# EAGLE design FAN-zero20-SHIM (EAGLE 9.6.2)
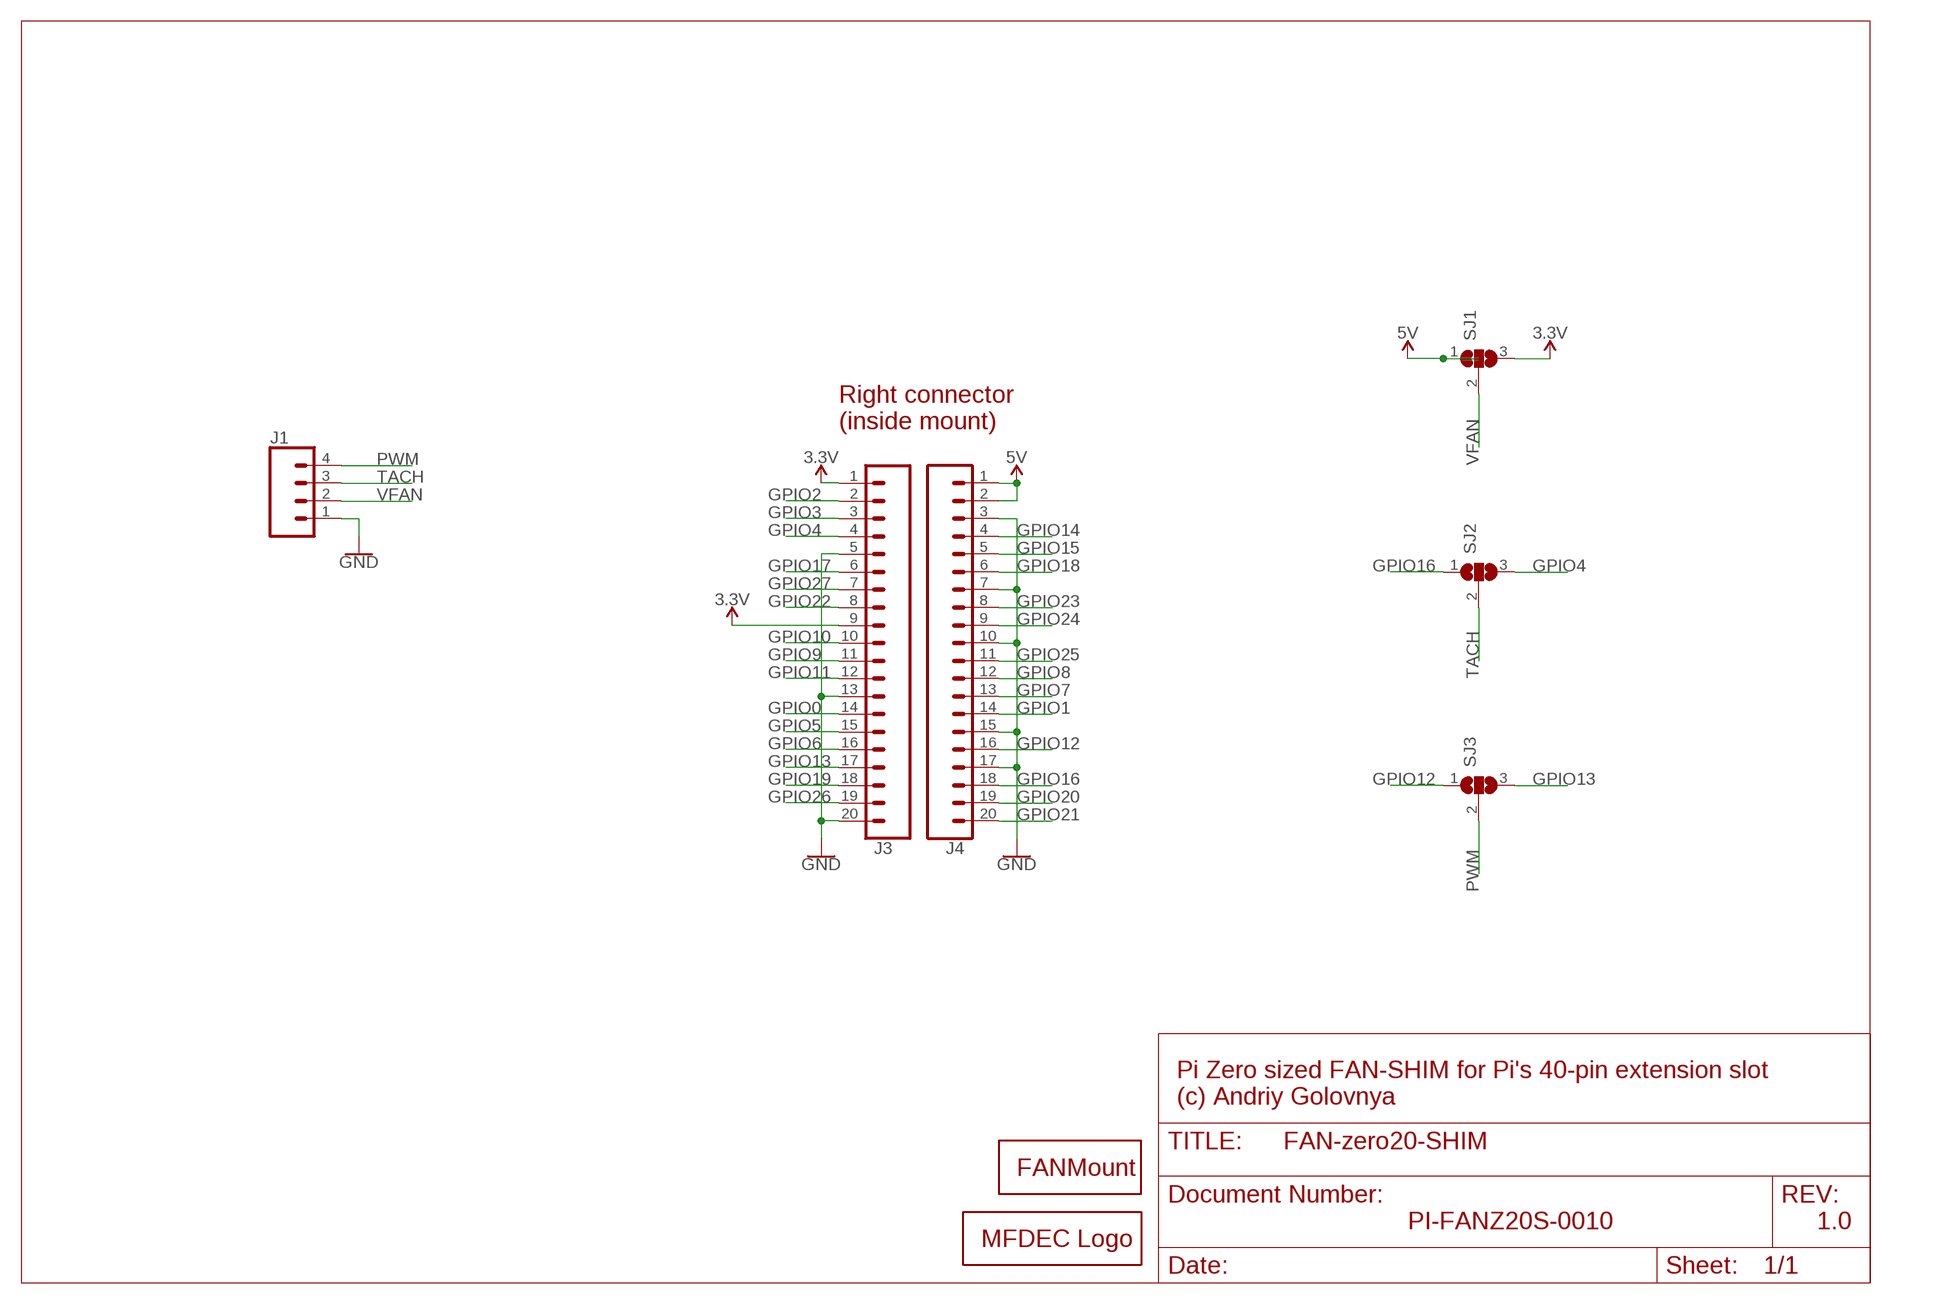
[diagram p0: schematic, sheet 1]

## Parts
FAN1  FAN20HO  [FAN20HO]
J1  CONN_04  [1X04]
J3  CONN_20LOCK  [1X20_LOCK]
J4  CONN_20LOCK  [1X20_LOCK]
LOGO1  MFDECLOGO_L_30MM  [MFDEC_L_30MM]
SJ1  SJ2  [SJ_2]
SJ2  SJ2  [SJ_2]
SJ3  SJ2  [SJ_2]

## Nets
3.3V: J3.1 J3.9 SJ1.3
5V: J4.1 J4.2 SJ1.1
GND: J1.1 J3.5 J3.13 J3.20 J4.3 J4.7 J4.10 J4.15 J4.17
GPIO0: J3.14
GPIO1: J4.14
GPIO2: J3.2
GPIO3: J3.3
GPIO4: J3.4 SJ2.3
GPIO5: J3.15
GPIO6: J3.16
GPIO7: J4.13
GPIO8: J4.12
GPIO9: J3.11
GPIO10: J3.10
GPIO11: J3.12
GPIO12: J4.16 SJ3.1
GPIO13: J3.17 SJ3.3
GPIO14: J4.4
GPIO15: J4.5
GPIO16: J4.18 SJ2.1
GPIO17: J3.6
GPIO18: J4.6
GPIO19: J3.18
GPIO20: J4.19
GPIO21: J4.20
GPIO22: J3.8
GPIO23: J4.8
GPIO24: J4.9
GPIO25: J4.11
GPIO26: J3.19
GPIO27: J3.7
PWM: J1.4 SJ3.2
TACH: J1.3 SJ2.2
VFAN: J1.2 SJ1.2

## Notes on the sheet
- Right connector
  (inside mount)
- Pi Zero sized FAN-SHIM for Pi's 40-pin extension slot
  (c) Andriy Golovnya
- PI-FANZ20S-0010 | 1.0

## Library data of the parts
FAN1 = _my_fans:FAN: Fan mount holes: 17mm 20mm 25mm 30mm 40mm 50mm 60mm
J1 = SparkFun-Connectors:CONN_04: Multi connection point. Often used as Generic Header-pin footprint for 0.1 inch spaced/style header connections On any of the 0.1 inch spaced packages, you can populate with these: Break Away Headers - Straight <https://www.sparkfun.com/products/116> (PRT-00116) Break Away Male Headers - Right Angle <https://www.sparkfun.com/products/553> (PRT-00553) Female Headers <https://www.sparkfun.com/products/115> (PRT-00115) Break Away Headers - Machine Pin <https://www.sparkfun.com/products/117> (PRT-00117) Break Away Female Headers - Swiss Machine Pin <https://www.sparkfun.com/products/743> (PRT-00743) For SCREWTERMINALS and SPRING TERMINALS visit here: Screw Terimnals on SparkFun.com <https://www.sparkfun.com/search/results?term=Screw+Terminals> (5mm/3.5mm/2.54mm spacing) This device is also useful as a general connection point to wire up your design to another part of your project. Our various solder wires solder well into these plated through hole pads. Hook-Up Wire - Assortment (Stranded, 22 AWG) <https://www.sparkfun.com/products/11375> (PRT-11375) Hook-Up Wire - Assortment (Solid Core, 22 AWG) <https://www.sparkfun.com/products/11367> (PRT-11367) View the entire wire category on our website here <https://www.sparkfun.com/categories/141> Special notes: Molex polarized connector foot print use with SKU : PRT-08231 with associated crimp pins and housings. 1MM SMD Version SKU: PRT-10208; PROD_ID: CONN-09696
J3 J4 = _my_locked_connectors:CONN_20: Multi connection point. Often used as Generic Header-pin footprint for 0.1 inch spaced/style header connections On any of the 0.1 inch spaced packages, you can populate with these: Break Away Headers - Straight <https://www.sparkfun.com/products/116> (PRT-00116) Break Away Male Headers - Right Angle <https://www.sparkfun.com/products/553> (PRT-00553) Female Headers <https://www.sparkfun.com/products/115> (PRT-00115) Break Away Headers - Machine Pin <https://www.sparkfun.com/products/117> (PRT-00117) Break Away Female Headers - Swiss Machine Pin <https://www.sparkfun.com/products/743> (PRT-00743) For SCREWTERMINALS and SPRING TERMINALS visit here: Screw Terimnals on SparkFun.com <https://www.sparkfun.com/search/results?term=Screw+Terminals> (5mm/3.5mm/2.54mm spacing) This device is also useful as a general connection point to wire up your design to another part of your project. Our various solder wires solder well into these plated through hole pads. Hook-Up Wire - Assortment (Stranded, 22 AWG) <https://www.sparkfun.com/products/11375> (PRT-11375) Hook-Up Wire - Assortment (Solid Core, 22 AWG) <https://www.sparkfun.com/products/11367> (PRT-11367) View the entire wire category on our website here <https://www.sparkfun.com/categories/141> Special notes: Molex polarized connector foot print use with SKU : PRT-08231 with associated crimp pins and housings. 1MM SMD Version SKU: PRT-10208 NOTES ON THE VARIANTS LOCK and LOCK_LONGPADS... This footprint was designed to help hold the alignment of a through-hole component (i.e. 6-pin header) while soldering it into place. You may notice that each hole has been shifted either up or down by 0.005 of an inch from it's more standard position (which is a perfectly straight line). This slight alteration caused the pins (the squares in the middle) to touch the edges of the holes. Because they are alternating, it causes a "brace" to hold the component in place. 0.005 has proven to be the perfect amount of "off-center" position when using our standard breakaway headers. Although looks a little odd when you look at the bare footprint, once you have a header in there, the alteration is very hard to notice. Also,if you push a header all the way into place, it is covered up entirely on the bottom side. Note about LOCK SPECIAL package: This is just like the LOCK variant in that the holes are staggared by 5 mil, but except for the last two holes. They are not altered from the "standard" footprint layout. This is used for a special purpose on the layout of our Graphic LCD Backpack. Make sure you want to use this device before selecting it for you project!
LOGO1 = _my_logos:MFDECLOGO: Midnight Fog - Digital Eye Candy LOGO
SJ1-SJ3 = _my_jumpers:SJ2: SMD solder JUMPER SJ2 - simple jumper SJ2FI - fancy inside jumper SJ2FO - fancy outside jumper SJ2FL - fancy left jumper SJ2FR - fancy right jumper SJ2W - wide jumper

## Board
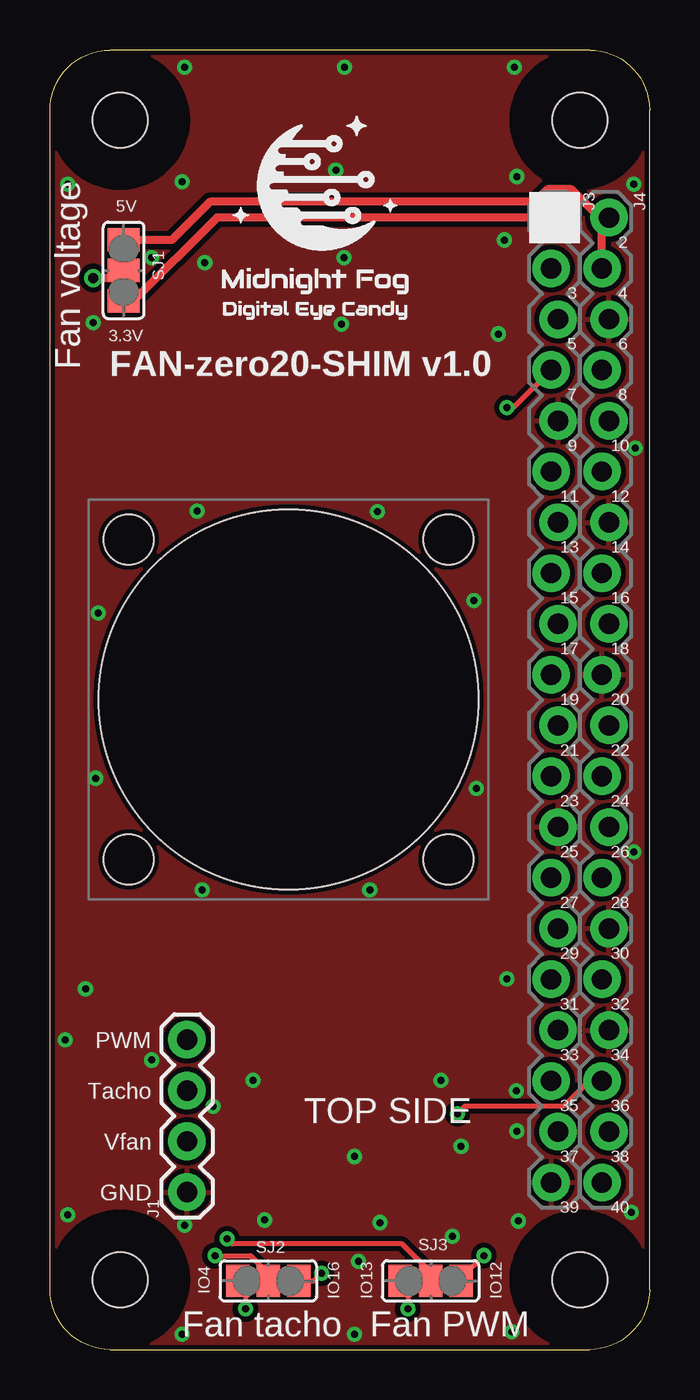
[diagram p1: board, top side]
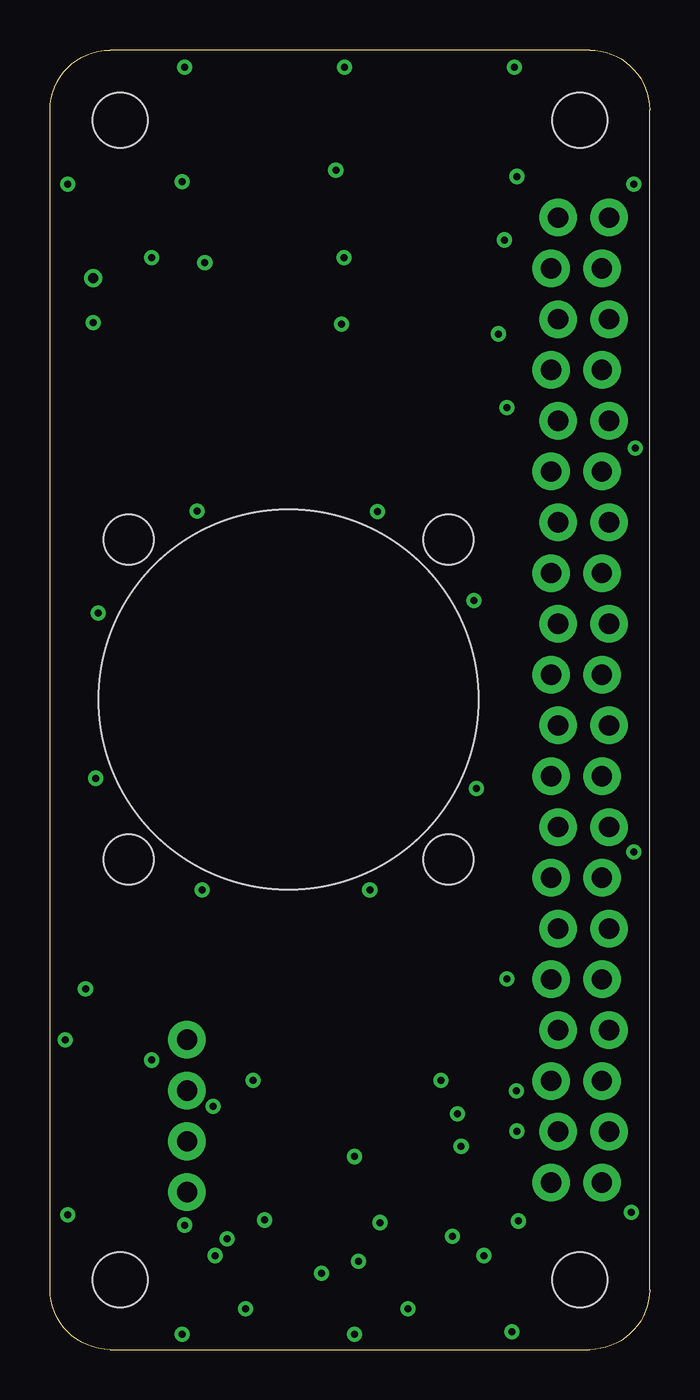
[diagram p2: board, inner layer Route2]
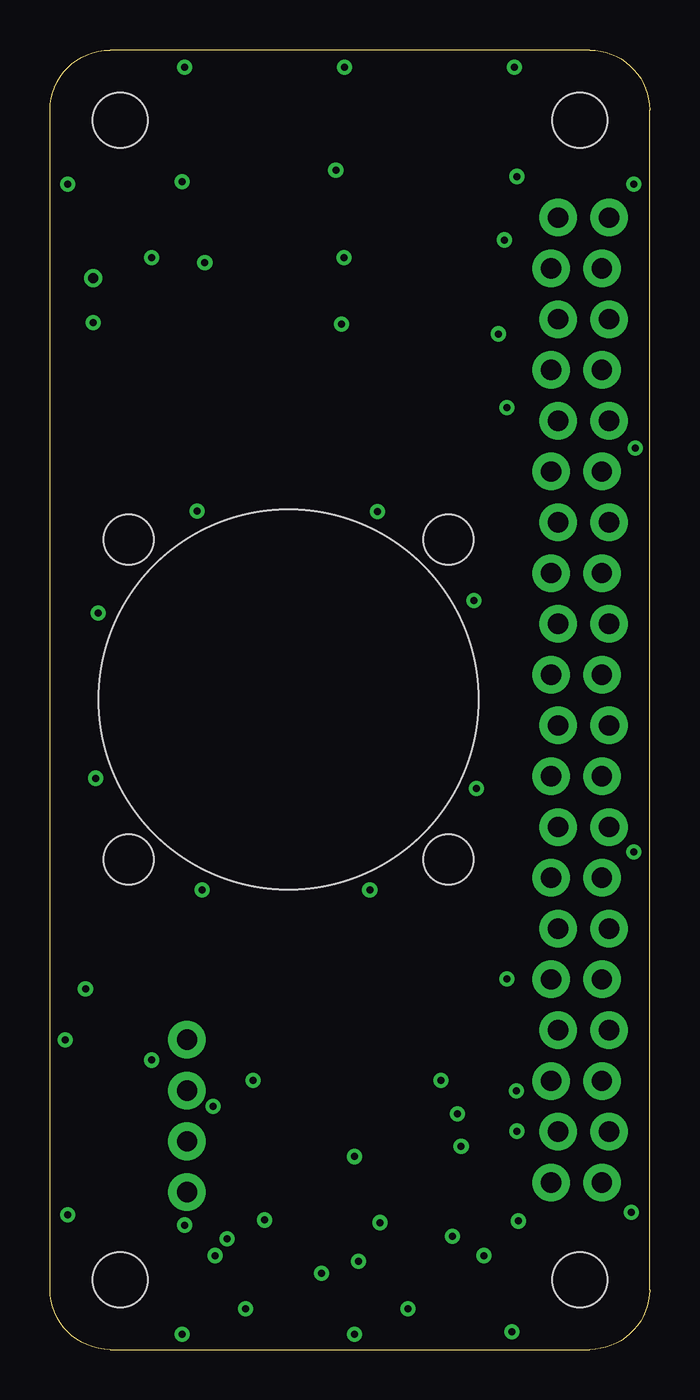
[diagram p3: board, inner layer Route15]
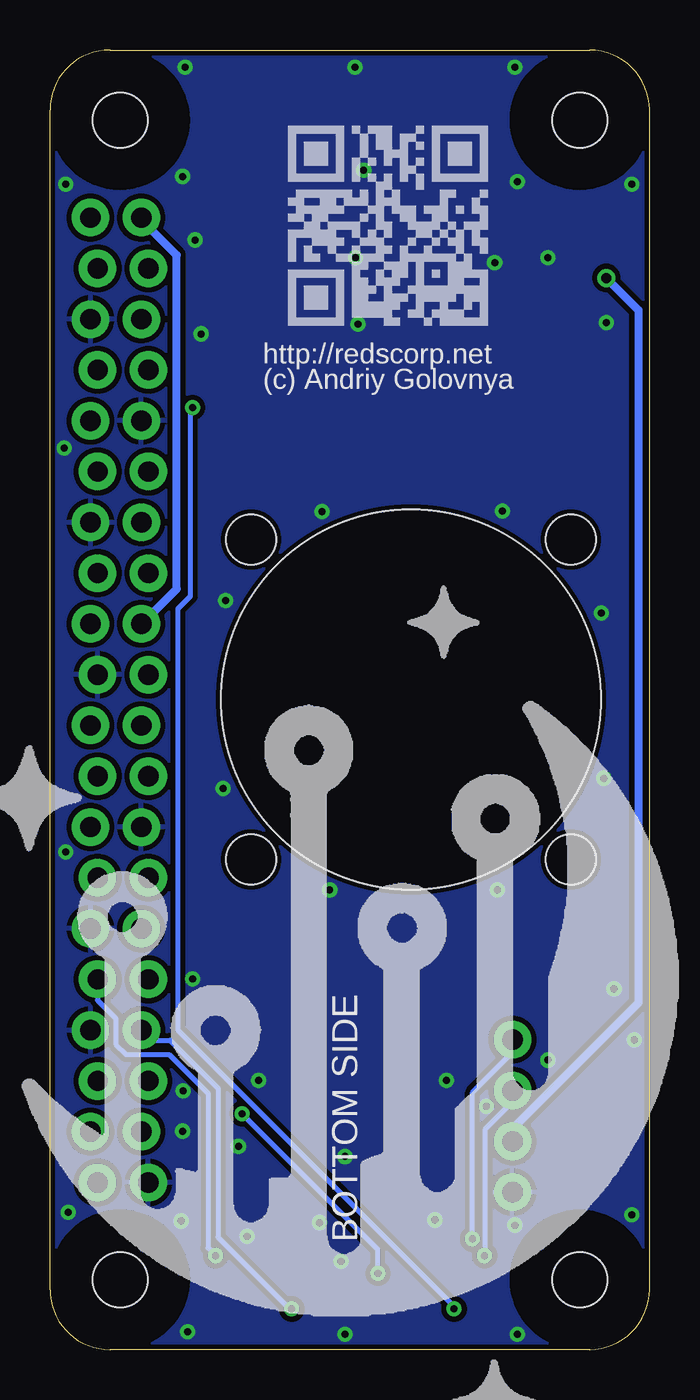
[diagram p4: board, bottom side, seen from below]

Size 30 x 65 mm. Coordinates in mm from the lower left corner, seen from the top.
Outline: 0,3 arc90 3,0 27,0 arc90 30,3 30,62 arc90 27,65 3,65 arc90 0,62
Outline: 0,3 arc0 0,3
Outline: 0,62 arc0 0,62
Outline: 0,3 0,62
Copper layers (1*16): Top 0.035mm / dielectric 1.5mm / Bottom 0.035mm
Design rules "default *": minimum track width 6mil, minimum drill 0.35mm, track to track 6mil, track to pad 6mil, pad to pad 6mil, via to via 6mil, smd to smd 6mil, copper to edge 6mil, drill to drill 6mil, minimum pad ring 10mil, minimum via ring 8mil, stop-mask expansion 4mil, vias tented up to drill 20mil, thermal gap 10mil
Holes 2.75 mm at 3.5,3.5 26.5,3.5 3.5,61.5 26.5,61.5

### Footprints (pad centres in the part's own frame; a part is rotated, then mirrored left to right if it is on the bottom)
FAN20HO = hole 2.5: -8,8; 8,8; -8,-8; 8,-8 | hole 19: 0,0
1X04 = drill 1.016 pad 1.88: 1 0,0; 2 2.54,0; 3 5.08,0; 4 7.62,0
1X20_LOCK = drill 1.016 pad 1.88: 1 0,0.178; 2 2.54,-0.178; 3 5.08,0.178; 4 7.62,-0.178; 5 10.16,0.178; 6 12.7,-0.178; 7 15.24,0.178; 8 17.78,-0.178; 9 20.32,0.178; 10 22.86,-0.178; 11 25.4,0.178; 12 27.94,-0.178; 13 30.48,0.178; 14 33.02,-0.178; 15 35.56,0.178; 16 38.1,-0.178; 17 40.64,0.178; 18 43.18,-0.178; 19 45.72,0.178; 20 48.26,-0.178
SJ_2 = smd 1.168 x 1.6: 1 -1.524,0; 2 0,0; 3 1.524,0

### Placement (x,y rotation side)
FAN1  11.94,32.51 0 top
J1  6.86,7.87 90 top
J3  25.25,56.62 270 top
J4  27.79,56.62 270 top
LOGO1  -4.19,-7.11 90 bottom  (outside the outline)
LOGO2  MFDECLOGO_SQ_8MM  [MFDEC_SQ_8MM]  7.93,51.21 0 top
LOGO3  RSNURL_QR_10MM  [RSNURL_QR_10MM]  18.09,51.21 0 bottom
SJ1  3.68,53.98 270 top
SJ2  10.92,3.43 180 top
SJ3  19.05,3.43 180 top

### Tracks (layer width: path | path; a pad name or v marks a point on that pad's centre or on a via)
3.3V
  Top 0.406: J3.1 8.36,56.62 4.19,52.45 SJ1.3
  Bottom 0.406: J3.1 25.43,56.52 23.65,54.74 23.65,38.04 25.4,36.3 J3.9
5V
  Top 0.406: J4.2 27.62,56.26 J4.1 27.52,56.62 26.1,58.04 24.9,58.04 24.26,57.4 8,57.4 6.1,55.5 SJ1.1
GND  (via drill 0.35)
  other vias: 23.11,0.89 29.08,6.86 6.6,0.76 0.89,6.73 6.73,6.22 10.74,6.48 15.44,4.42 20.57,10.16 16.51,6.35 10.16,13.46 15.24,9.65 7.62,22.99 16,22.99 21.34,28.07 22.86,18.54 19.56,13.46 0.89,58.29 6.73,64.14 23.24,64.14 29.21,58.29 14.73,64.14 23.37,58.67 22.73,55.5 5.08,54.61 6.6,58.42 7.75,54.36 21.21,37.47 16.38,41.91 7.37,41.94 29.29,45.09 29.21,24.89 8.15,12.17 15.24,0.76 23.34,12.93 23.37,10.92 14.3,58.98 14.71,54.61 22.43,50.8 14.58,51.28 2.16,51.36 20.14,5.66 23.44,6.43 0.76,15.49 5.08,14.48 1.78,18.03 2.29,28.57 2.41,36.83
  pour Top (isolate 0.254): -8.89,0 -8.89,65.15 30.23,65.15 30.23,0
  pour Bottom (isolate 0.254): -8.89,0 -8.89,65.15 30.23,65.15 30.23,0
GND1
  cutout Top: 26.5,0 arc-180 26.5,7 arc-180
  cutout Route2: 26.5,0 arc-180 26.5,7 arc-180
  cutout Route15: 26.5,0 arc-180 26.5,7 arc-180
  cutout Bottom: 26.5,0 arc-180 26.5,7 arc-180
GND2
  cutout Top: 3.5,58 arc-180 3.5,65 arc-180
  cutout Route2: 3.5,58 arc-180 3.5,65 arc-180
  cutout Route15: 3.5,58 arc-180 3.5,65 arc-180
  cutout Bottom: 3.5,58 arc-180 3.5,65 arc-180
GND3
  cutout Top: 26.5,58 arc-180 26.5,65 arc-180
  cutout Route2: 26.5,58 arc-180 26.5,65 arc-180
  cutout Route15: 26.5,58 arc-180 26.5,65 arc-180
  cutout Bottom: 26.5,58 arc-180 26.5,65 arc-180
GND4
  cutout Top: 3.5,0 arc-180 3.5,7 arc-180
  cutout Route2: 3.5,0 arc-180 3.5,7 arc-180
  cutout Route15: 3.5,0 arc-180 3.5,7 arc-180
  cutout Bottom: 3.5,0 arc-180 3.5,7 arc-180
GPIO4  (via drill 0.35)
  Top 0.254: J3.4 23.2,47.12 v22.86,47.12 | v9.78,2.03 9.78,3.05 SJ2.3
  Bottom 0.254: v22.86,47.12 22.99,46.99 22.99,37.66 23.6,37.05 23.6,15.98 9.78,2.16 v9.78,2.03
GPIO12  (via drill 0.35)
  Top 0.254: SJ3.1 20.57,3.56 v21.72,4.7
  Bottom 0.254: J4.16 27.62,17.47 26.7,16.56 26.7,15.27 26.19,14.76 24.04,14.76 22.1,12.82 22.1,5.08 v21.72,4.7
GPIO13  (via drill 0.35)
  Top 0.254: SJ3.3 17.91,3.05 v17.91,2.03
  Bottom 0.254: J3.17 24.92,15.47 23.98,15.47 21.59,13.07 21.59,5.61 18.01,2.03 v17.91,2.03
GPIO16  (via drill 0.35)
  Top 0.254: J4.18 26.98,13.44 25.71,12.16 20.76,12.16 v20.39,11.79 | v13.59,3.81 13.21,3.43 SJ2.1
  Bottom 0.254: v20.39,11.79 13.59,5 v13.59,3.81
PWM  (via drill 0.35)
  Top 0.254: SJ3.2 19.05,3.85 17.63,5.28 9.12,5.28 v8.86,5.53
  Bottom 0.254: v8.86,5.53 8.86,12.86 6.86,14.86 J1.4
TACH  (via drill 0.35)
  Top 0.254: SJ2.2 10.54,3.81 10.54,4.19 10.03,4.7 v8.26,4.7
  Bottom 0.254: v8.26,4.7 8.2,4.75 8.2,11.05 6.86,12.39 J1.3
VFAN  (via drill 0.5)
  Top 0.152: SJ1.2 3.68,55.07
  Top 0.406: SJ1.2 3.3,53.59 v2.16,53.59
  Bottom 0.406: J1.2 6.86,11.05 0.56,17.35 0.56,51.99 v2.16,53.59

### Text on the board
tPlace: 5V | 2 | 3 | 4 | 3.3V | 5 | 6 | Fan voltage | FAN-zero20-SHIM v1.0 | 7 | 8 | 9 | 10 | 11 | 12 | 13 | 14 | 15 | 16 | 17 | 18 | 19 | 20 | 21 | 22 | 23 | 24 | 25 | 26 | 27 | 28 | 29 | 30 | 31 | 32 | PWM | 33 | 34 | Tacho | 35 | 36 | Vfan | TOP SIDE | 37 | 38 | GND | 39 | 40 | IO4 | IO16 | IO13 | IO12 | Fan tacho | Fan PWM
bPlace: http://redscorp.net | (c) Andriy Golovnya | BOTTOM SIDE